# EAGLE design hw-proto04 (EAGLE 7.3.0)
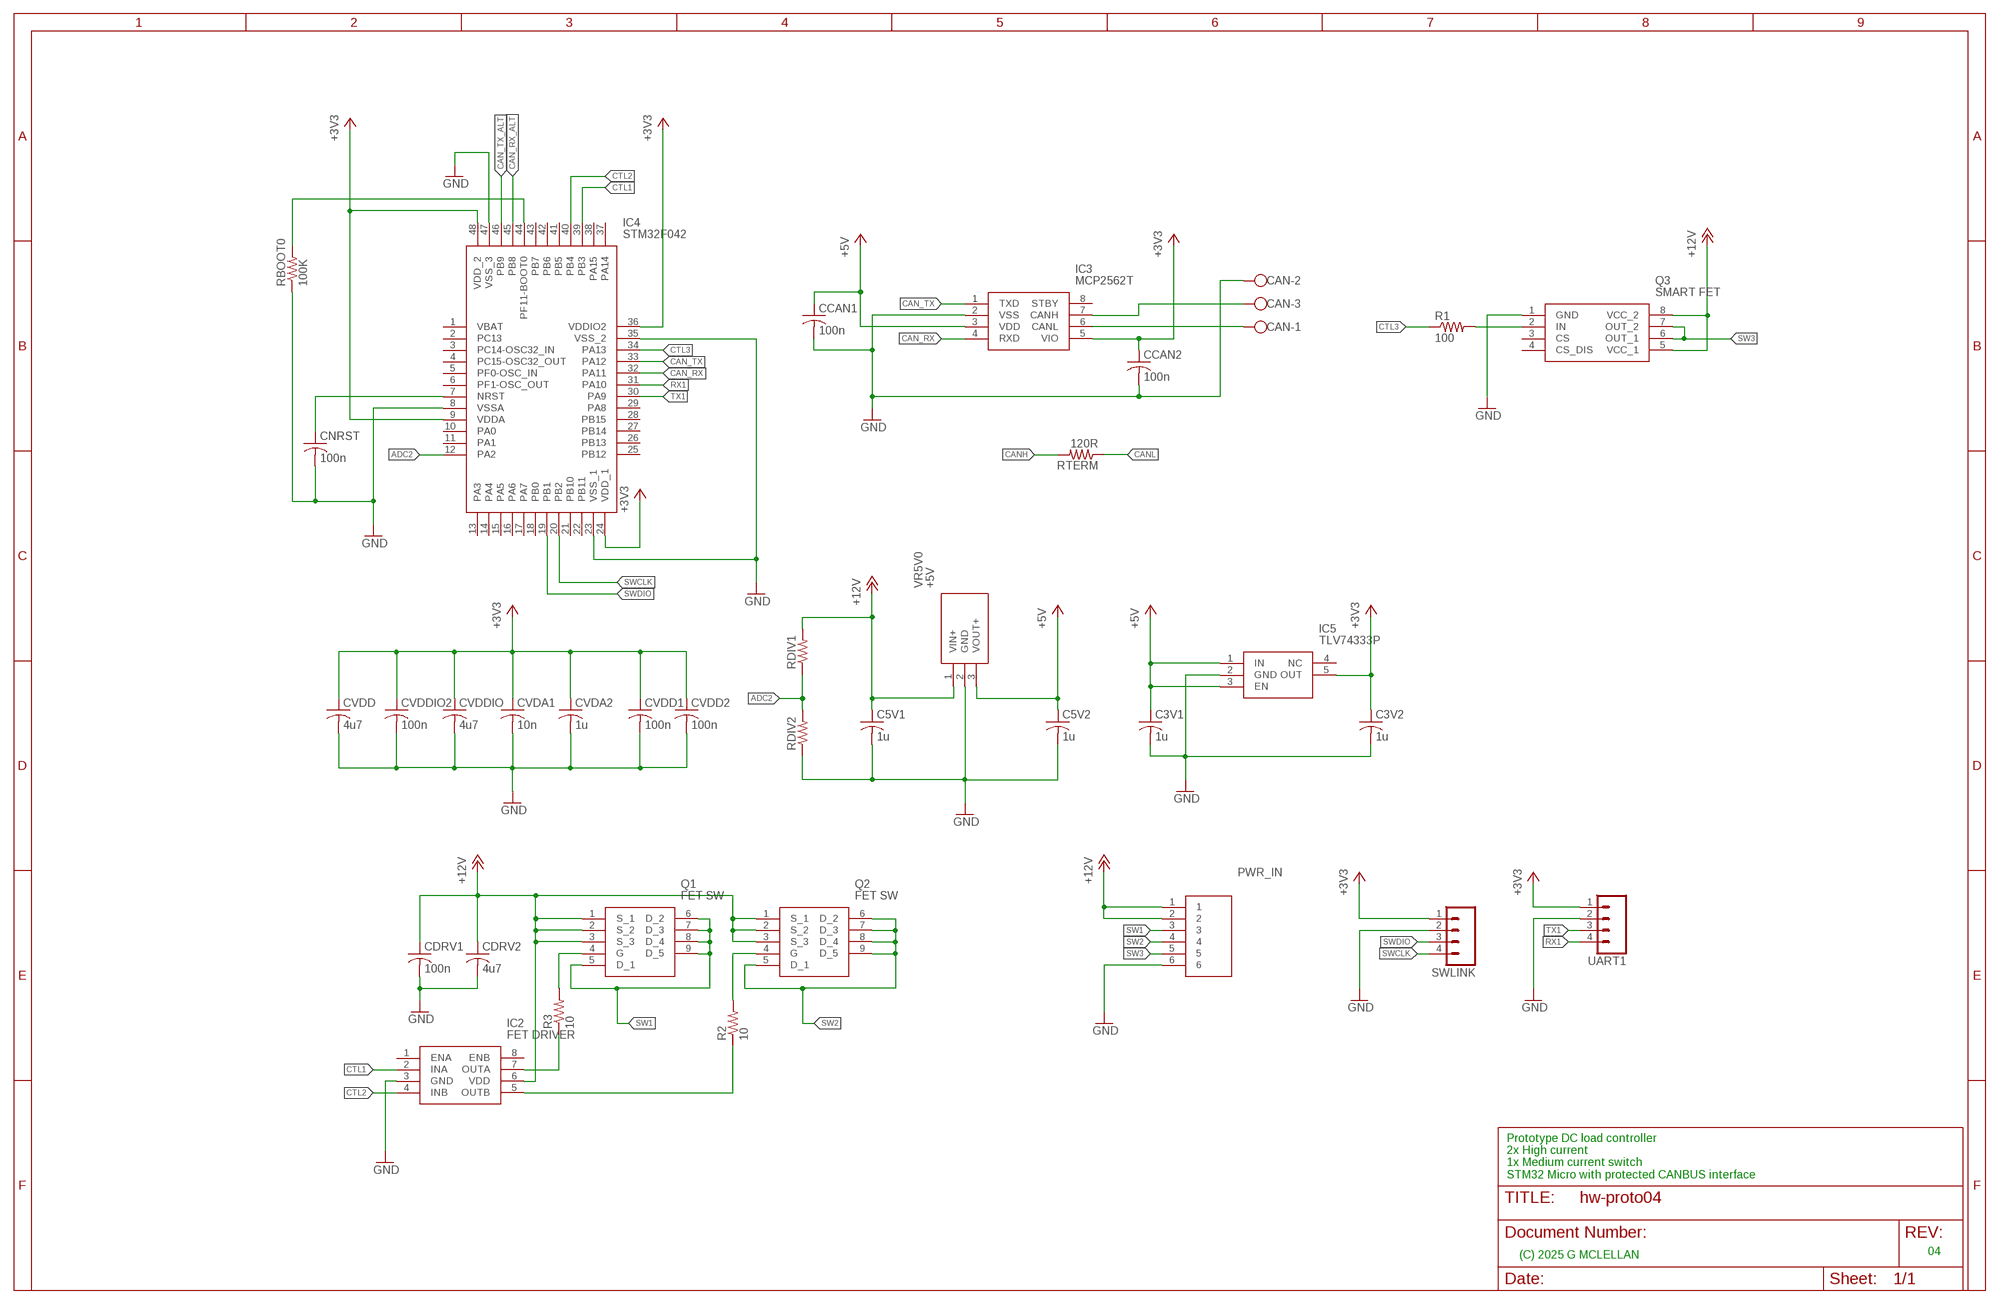
[diagram p0: schematic, sheet 1]

## Parts
C3V1  1u  C-USC0603K  [C0603K]
C3V2  1u  C-USC0603K  [C0603K]
C5V1  1u  C-USC0603K  [C0603K]
C5V2  1u  C-USC0603K  [C0603K]
CAN  W237-103  [W237-103]
CCAN1  100n  C-USC0603K  [C0603K]
CCAN2  100n  C-USC0603K  [C0603K]
CDRV1  100n  C-USC0603K  [C0603K]
CDRV2  4u7  C-USC0805K  [C0805K]
CNRST  100n  C-USC0603K  [C0603K]
CVDA1  10n  C-USC0603K  [C0603K]
CVDA2  1u  C-USC0603K  [C0603K]
CVDD  4u7  C-USC0603K  [C0603K]
CVDD1  100n  C-USC0603K  [C0603K]
CVDD2  100n  C-USC0603K  [C0603K]
CVDDIO  4u7  C-USC0603K  [C0603K]
CVDDIO2  100n  C-USC0603K  [C0603K]
IC2  FET DRIVER  UCC27523DR  [SOIC127P600X175-8N]
IC3  MCP2562T  MCP2562T-H_SN  [SOIC127P600X175-8N]
IC4  STM32F042  STM32F042C6T7  [QFP50P900X900X160-48N]
IC5  TLV74333P  TLV74333PDBVR  [SOT95P280X145-5N]
PWR_IN  4DB-P108-06  [4DBP10806]
Q1  FET SW  SQJ147ELP-T1_GE3  [SQJ147ELPT1_GE3]
Q2  FET SW  SQJ147ELP-T1_GE3  [SQJ147ELPT1_GE3]
Q3  SMART FET  VN5E160MSTR-E  [SOIC127P600X175-8N]
R1  100  R-US_0204/7  [0204/7]
R2  10  R-US_0204/7  [0204/7]
R3  10  R-US_0204/7  [0204/7]
RBOOT0  100K  R-US_R0603  [R0603]
RDIV1  R-US_R0805  [R0805]
RDIV2  R-US_R0805  [R0805]
RTERM  120R  R-US_R0805  [R0805]
SWLINK  M04LOCK  [1X04_LOCK]
UART1  M04LOCK  [1X04_LOCK]
VR5V0  +5V  TSR_1-2433E  [TSR-1-2433]

## Nets
+3V3: C3V2.1 CCAN2.1 CVDA1.1 CVDA2.1 CVDD1.1 CVDD2.1 CVDD.1 CVDDIO2.1 CVDDIO.1 IC3.5(VIO) IC4.9(VDDA) IC4.24(VDD_1) IC4.36(VDDIO2) IC4.48(VDD_2) IC5.5(OUT) SWLINK.1 UART1.1
+5V: C3V1.1 C5V2.1 CCAN1.1 IC3.3(VDD) IC5.1(IN) IC5.3(EN) VR5V0.3(VOUT+)
+12V: C5V1.1 CDRV1.1 CDRV2.1 IC2.6(VDD) PWR_IN.1 PWR_IN.2 Q1.1(S_1) Q1.2(S_2) Q1.3(S_3) Q2.1(S_1) Q2.2(S_2) Q2.3(S_3) Q3.5(VCC_1) Q3.8(VCC_2) RDIV1.2 VR5V0.1(VIN+)
ADC2: IC4.12(PA2) RDIV1.1 RDIV2.2
BOOT0: IC4.44(PF11-BOOT0) RBOOT0.2
CAN_RX: IC3.4(RXD) IC4.32(PA11)
CAN_RX_ALT: IC4.45(PB8)
CAN_TX: IC3.1(TXD) IC4.33(PA12)
CAN_TX_ALT: IC4.46(PB9)
CANH: CAN.3 IC3.7(CANH) RTERM.2
CANL: CAN.1 IC3.6(CANL) RTERM.1
CTL1: IC2.2(INA) IC4.39(PB3)
CTL2: IC2.4(INB) IC4.40(PB4)
CTL3: IC4.34(PA13) R1.1
GND: C3V1.2 C3V2.2 C5V1.2 C5V2.2 CAN.2 CCAN1.2 CCAN2.2 CDRV1.2 CDRV2.2 CNRST.2 CVDA1.2 CVDA2.2 CVDD1.2 CVDD2.2 CVDD.2 CVDDIO2.2 CVDDIO.2 IC2.3(GND) IC3.2(VSS) IC4.8(VSSA) IC4.23(VSS_1) IC4.35(VSS_2) IC4.47(VSS_3) IC5.2(GND) PWR_IN.6 Q3.1(GND) RBOOT0.1 RDIV2.1 SWLINK.2 UART1.2 VR5V0.2(GND)
N$3: IC2.5(OUTB) R2.1
N$4: IC2.7(OUTA) R3.1
N$5: Q1.4(G) R3.2
N$6: Q2.4(G) R2.2
N$7: Q3.2(IN) R1.2
N$8: CNRST.1 IC4.7(NRST)
RX1: IC4.31(PA10) UART1.4
SW1: PWR_IN.3 Q1.5(D_1) Q1.6(D_2) Q1.7(D_3) Q1.8(D_4) Q1.9(D_5)
SW2: PWR_IN.4 Q2.5(D_1) Q2.6(D_2) Q2.7(D_3) Q2.8(D_4) Q2.9(D_5)
SW3: PWR_IN.5 Q3.6(OUT_1) Q3.7(OUT_2)
SWCLK: IC4.20(PB2) SWLINK.4
SWDIO: IC4.19(PB1) SWLINK.3
TX1: IC4.30(PA9) UART1.3
Unconnected: IC2.1(ENA) IC2.8(ENB) IC3.8(STBY) IC4.1(VBAT) IC4.2(PC13) IC4.3(PC14-OSC32_IN) IC4.4(PC15-OSC32_OUT) IC4.5(PF0-OSC_IN) IC4.6(PF1-OSC_OUT) IC4.10(PA0) IC4.11(PA1) IC4.13(PA3) IC4.14(PA4) IC4.15(PA5) IC4.16(PA6) IC4.17(PA7) IC4.18(PB0) IC4.21(PB10) IC4.22(PB11) IC4.25(PB12) IC4.26(PB13) IC4.27(PB14) IC4.28(PB15) IC4.29(PA8) IC4.37(PA14) IC4.38(PA15) IC4.41(PB5) IC4.42(PB6) IC4.43(PB7) IC5.4(NC) Q3.3(CS) Q3.4(CS_DIS)

## Notes on the sheet
- Prototype DC load controller
  2x High current 
  1x Medium current switch 
  STM32 Micro with protected CANBUS interface
- 04
- (C) 2025 G MCLELLAN

## Library data of the parts
C3V1 C3V2 C5V1 C5V2 CCAN1 CCAN2 CDRV1 CDRV2 CNRST CVDA1 CVDA2 CVDD CVDD1 CVDD2 CVDDIO CVDDIO2 = rcl:C-US: CAPACITOR, American symbol
CAN = con-wago-500:W237-103: WAGO SCREW CLAMP; MPN: 237-103; OC_FARNELL: unknown; OC_NEWARK: 18M7116
IC2 = UCC27523DR-fet-driver:UCC27523DR: Dual, 5A, High-Speed Low-Side Power MOSFET Driver Source: Datasheet <http://www.ti.com/lit/gpn/ucc27523>; DESCRIPTION: Dual, 5A, High-Speed Low-Side Power MOSFET Driver; HEIGHT: 1.75mm; MANUFACTURER_NAME: Texas Instruments; MANUFACTURER_PART_NUMBER: UCC27523DR; MOUSER_PART_NUMBER: 595-UCC27523DR; MOUSER_PRICE-STOCK: https://www.mouser.co.uk/ProductDetail/Texas-Instruments/UCC27523DR/?qs=JK0Mn6q9DKQ5jNt3UHw5hw%3D%3D
IC3 = MCP2562T-H_SN:MCP2562T-H_SN: CAN Interface IC Source: Datasheet <https://componentsearchengine.com/Datasheets/1/MCP2562T-H_SN.pdf>; DESCRIPTION: CAN Interface IC; HEIGHT: 1.75mm; MANUFACTURER_NAME: Microchip; MANUFACTURER_PART_NUMBER: MCP2562T-H/SN; MOUSER_PART_NUMBER: 579-MCP2562T-H/SN; MOUSER_PRICE-STOCK: https://www.mouser.co.uk/ProductDetail/Microchip-Technology/MCP2562T-H-SN?qs=eTPcRhULBzwloCb8Xxk0jQ%3D%3D
IC4 = STM32F042C6T7:STM32F042C6T7: Mainstream Arm Cortex-M0 USB line MCU with 32 Kbytes of Flash memory, 48 MHz CPU, USB, CAN and CEC functions Source: Datasheet <https://www.st.com/resource/en/datasheet/stm32f042c4.pdf>; DESCRIPTION: Mainstream Arm Cortex-M0 USB line MCU with 32 Kbytes of Flash memory, 48 MHz CPU, USB, CAN and CEC functions; HEIGHT: 1.6mm; MANUFACTURER_NAME: STMicroelectronics; MANUFACTURER_PART_NUMBER: STM32F042C6T7; MOUSER_PART_NUMBER: 511-STM32F042C6T7; MOUSER_PRICE-STOCK: https://www.mouser.co.uk/ProductDetail/STMicroelectronics/STM32F042C6T7?qs=PqoDHHvF6499eidad5TESA%3D%3D
IC5 = TLV74333PDBVR:TLV74333PDBVR: 300mA Low-Dropout (LDO) Regulator Source: Datasheet <http://www.ti.com/lit/gpn/tlv743p>; DESCRIPTION: 300mA Low-Dropout (LDO) Regulator; HEIGHT: 1.45mm; MANUFACTURER_NAME: Texas Instruments; MANUFACTURER_PART_NUMBER: TLV74333PDBVR; MOUSER_PART_NUMBER: 595-TLV74333PDBVR; MOUSER_PRICE-STOCK: https://www.mouser.co.uk/ProductDetail/Texas-Instruments/TLV74333PDBVR?qs=EU6FO9ffTwe08kePOwcQGA%3D%3D
PWR_IN = 4DB-P108-06:4DB-P108-06: Dual Barrier, Printed Circuit Pin, Wire-to-Board, 6 Position, 8.26 mm [.325 in] Centerline, 1 Row, Buchanan 4DB Series, Barrier Strips Source: Datasheet <https://www.te.com/commerce/DocumentDelivery/DDEController?Action=srchrtrv&DocNm=1-1773458-2_BARRIER_STRIPS_QRG&DocType=Data Sheet&DocLang=English&PartCntxt=2-1437667-9&DocFormat=pdf>; DESCRIPTION: Dual Barrier, Printed Circuit Pin, Wire-to-Board, 6 Position, 8.26 mm [.325 in] Centerline, 1 Row, Buchanan 4DB Series, Barrier Strips; HEIGHT: 13.716mm; MANUFACTURER_NAME: TE Connectivity; MANUFACTURER_PART_NUMBER: 4DB-P108-06; MOUSER_PART_NUMBER: N/A; MOUSER_PRICE-STOCK: https://www.mouser.co.uk/ProductDetail/TE-Connectivity/4DB-P108-06?qs=JZD3Rbs9Xzm1xbyNfnCHaQ%3D%3D
Q1 Q2 = transistor-vishay-pchan-pso8:SQJ147ELP-T1_GE3: MOSFET P-CHANNEL 40-V (D-S) 175C MOSFET Source: Datasheet <https://www.vishay.com/docs/77857/sqj147elp.pdf>; DESCRIPTION: MOSFET P-CHANNEL 40-V (D-S) 175C MOSFET; HEIGHT: 1.227mm; MANUFACTURER_NAME: Vishay; MANUFACTURER_PART_NUMBER: SQJ147ELP-T1_GE3; MOUSER_PART_NUMBER: 78-SQJ147ELP-T1_GE3; MOUSER_PRICE-STOCK: https://www.mouser.co.uk/ProductDetail/Vishay-Siliconix/SQJ147ELP-T1_GE3?qs=81r%252BiQLm7BRdyhBg3DuaKw%3D%3D
Q3 = VN5E160MSTR-E:VN5E160MSTR-E: Gate Drivers SNGL CH HI-SIDE DRVR W/ANALOG CRRNT SNSE Source: Datasheet <https://componentsearchengine.com/Datasheets/2/VN5E160MSTR-E.pdf>; DESCRIPTION: Gate Drivers SNGL CH HI-SIDE DRVR W/ANALOG CRRNT SNSE; HEIGHT: 1.75mm; MANUFACTURER_NAME: STMicroelectronics; MANUFACTURER_PART_NUMBER: VN5E160MSTR-E; MOUSER_PART_NUMBER: 511-VN5E160MSTR-E; MOUSER_PRICE-STOCK: https://www.mouser.co.uk/ProductDetail/STMicroelectronics/VN5E160MSTR-E?qs=WSSg0AwdCh77XxtxsYEeyw%3D%3D
R1-R3 RBOOT0 RDIV1 RDIV2 RTERM = rcl:R-US_: RESISTOR, American symbol
SWLINK UART1 = SparkFun-Connectors:M04: Header 4 Standard 4-pin 0.1" header. Use with straight break away headers (SKU : PRT-00116), right angle break away headers (PRT-00553), swiss pins (PRT-00743), machine pins (PRT-00117), and female headers (PRT-00115). Molex polarized connector foot print use with SKU : PRT-08231 with associated crimp pins and housings. 1MM SMD Version SKU: PRT-10208; PROD_ID: CONN-09696
VR5V0 = TSR_1-2433E:TSR_1-2433E: 1 Amp POL converter, industrial, 6-36 VDC input, pos.-pos. circuit, cost efficient, LM78 compatible, SIP-3 Source: Datasheet <https://tracopower.com/tsr1e-datasheet/>; DESCRIPTION: 1 Amp POL converter, industrial, 6-36 VDC input, pos.-pos. circuit, cost efficient, LM78 compatible, SIP-3; HEIGHT: mm; MANUFACTURER_NAME: Traco Power; MANUFACTURER_PART_NUMBER: TSR 1-2433E; MOUSER_PART_NUMBER: 495-TSR1-2433E; MOUSER_PRICE-STOCK: https://www.mouser.co.uk/ProductDetail/TRACO-Power/TSR-1-2433E?qs=vmHwEFxEFR9haWIzn8wG3A%3D%3D

## Board
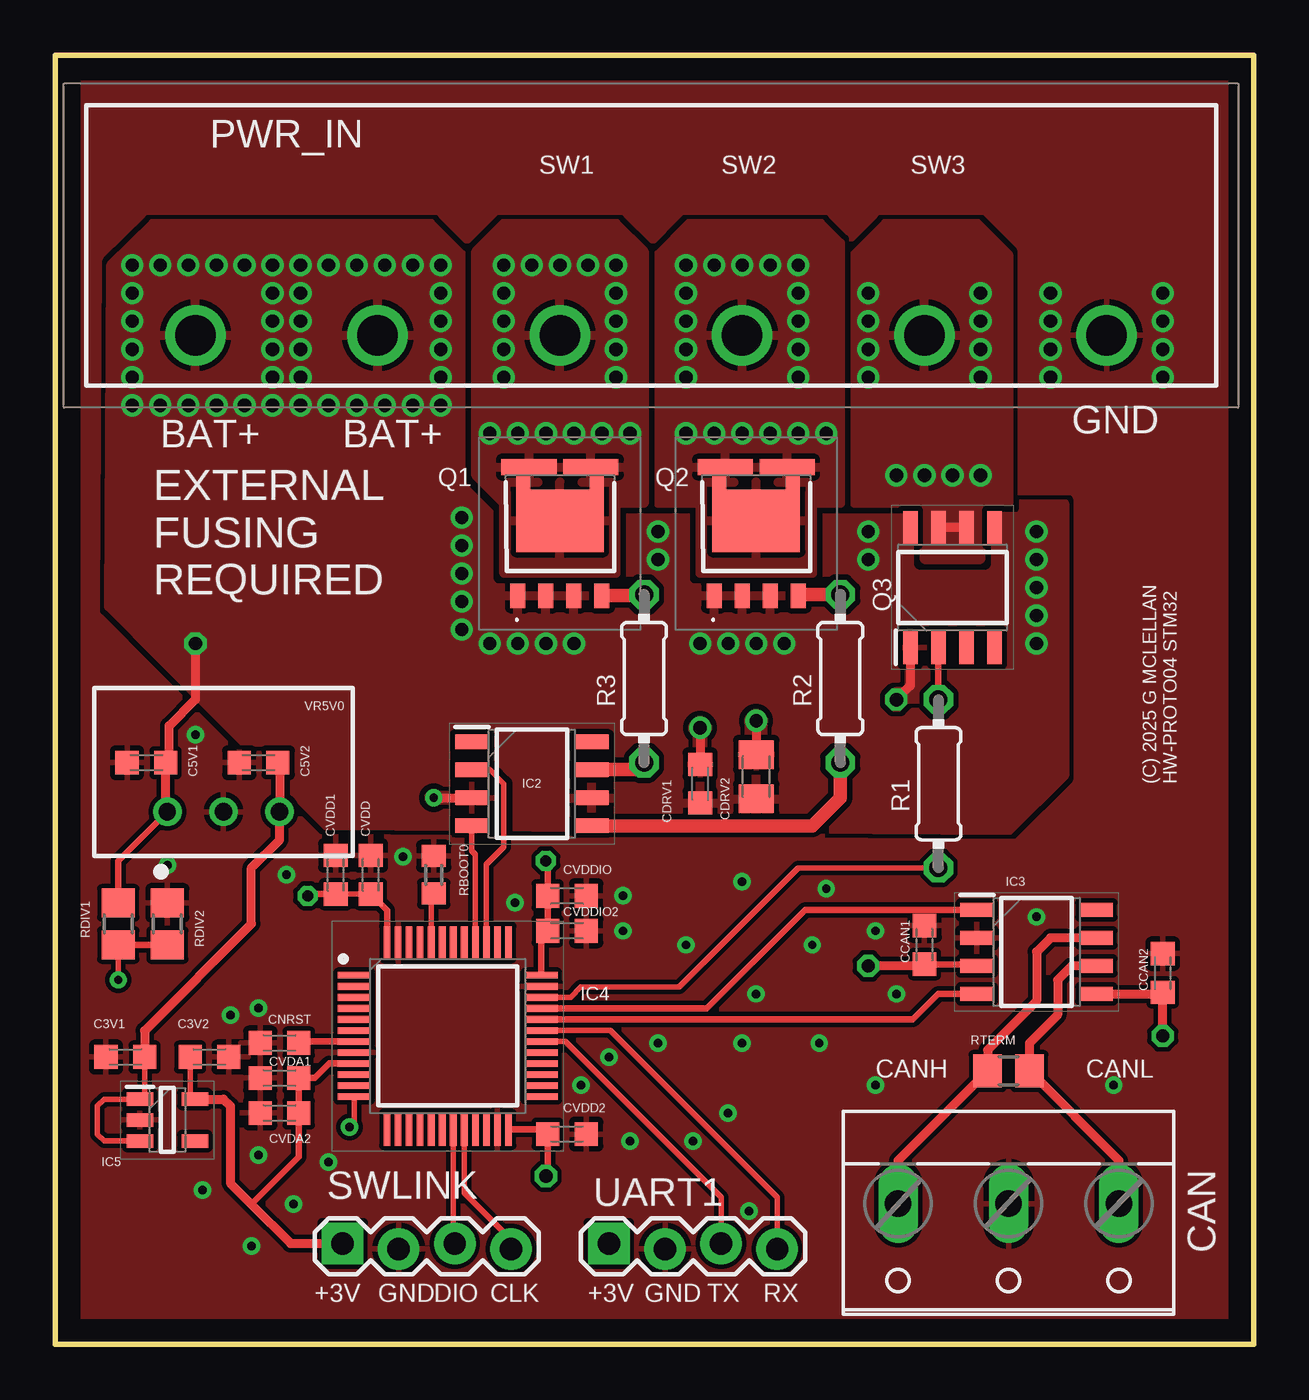
[diagram p1: board, top side]
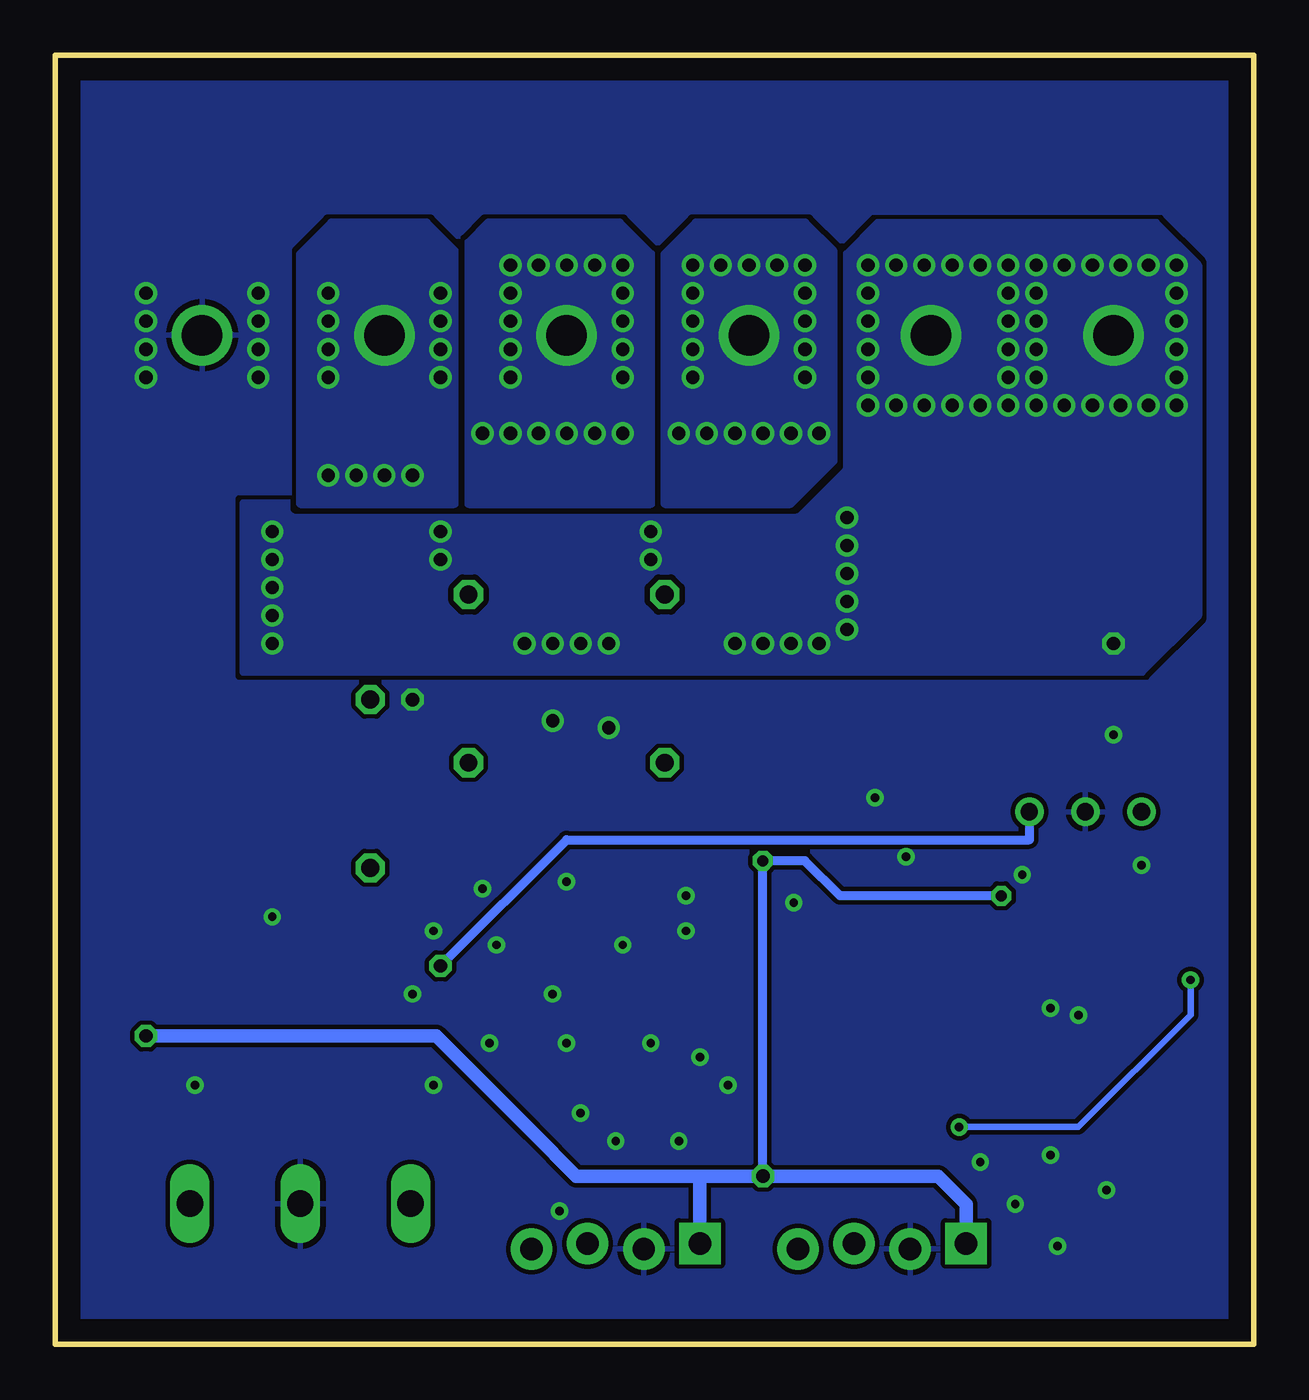
[diagram p2: board, bottom side, seen from below]

Size 54.28 x 58.41 mm. Coordinates in mm from the lower left corner, seen from the top.
Outline: 0,0 54.28,0 54.28,58.41 0,58.41 0,0
Copper layers (1*16): Top 0.035mm / dielectric 1.5mm / Bottom 0.035mm
Design rules "default": minimum track width 10mil, minimum drill 24mil, track to track 8mil, track to pad 8mil, pad to pad 8mil, via to via 8mil, smd to smd 8mil, copper to edge 40mil, drill to drill 8mil, minimum pad ring 10mil, minimum via ring 8mil, stop-mask expansion 4mil, vias tented up to drill 0mil, thermal gap 10mil

### Footprints (pad centres in the part's own frame; a part is rotated, then mirrored left to right if it is on the bottom)
C0603K = smd 1.05 x 1.08: 1 -0.875,0; 2 0.875,0
W237-103 = drill 1.194 long: 1 -5,-1.29; 2 0,-1.29; 3 5,-1.29
C0805K = smd 1.3 x 1.6: 1 -1,0; 2 1,0
SOIC127P600X175-8N = smd 1.525 x 0.65: 1 -2.712,1.905; 2 -2.712,0.635; 3 -2.712,-0.635; 4 -2.712,-1.905; 5 2.712,-1.905; 6 2.712,-0.635; 7 2.712,0.635; 8 2.712,1.905
SOIC127P600X175-8N' = smd 1.5 x 0.65: 1 -2.7,1.905; 2 -2.7,0.635; 3 -2.7,-0.635; 4 -2.7,-1.905; 5 2.7,-1.905; 6 2.7,-0.635; 7 2.7,0.635; 8 2.7,1.905
QFP50P900X900X160-48N = smd 1.475 x 0.3: 1 -4.238,2.75; 2 -4.238,2.25; 3 -4.238,1.75; 4 -4.238,1.25; 5 -4.238,0.75; 6 -4.238,0.25; 7 -4.238,-0.25; 8 -4.238,-0.75; 9 -4.238,-1.25; 10 -4.238,-1.75; 11 -4.238,-2.25; 12 -4.238,-2.75; 25 4.238,-2.75; 26 4.238,-2.25; 27 4.238,-1.75; 28 4.238,-1.25; 29 4.238,-0.75; 30 4.238,-0.25; 31 4.238,0.25; 32 4.238,0.75; 33 4.238,1.25; 34 4.238,1.75; 35 4.238,2.25; 36 4.238,2.75 | smd 0.3 x 1.475: 13 -2.75,-4.238; 14 -2.25,-4.238; 15 -1.75,-4.238; 16 -1.25,-4.238; 17 -0.75,-4.238; 18 -0.25,-4.238; 19 0.25,-4.238; 20 0.75,-4.238; 21 1.25,-4.238; 22 1.75,-4.238; 23 2.25,-4.238; 24 2.75,-4.238; 37 2.75,4.238; 38 2.25,4.238; 39 1.75,4.238; 40 1.25,4.238; 41 0.75,4.238; 42 0.25,4.238; 43 -0.25,4.238; 44 -0.75,4.238; 45 -1.25,4.238; 46 -1.75,4.238; 47 -2.25,4.238; 48 -2.75,4.238
SOT95P280X145-5N = smd 1.2 x 0.6: 1 -1.25,0.95; 2 -1.25,0; 3 -1.25,-0.95; 4 1.25,-0.95; 5 1.25,0.95
4DBP10806 = drill 1.829 pad 2.743: 1 0,0; 2 8.255,0; 3 16.51,0; 4 24.765,0; 5 33.02,0; 6 41.275,0
SQJ147ELPT1_GE3 = smd 0.68 x 1.1: 1 -1.905,-2.913; 2 -0.635,-2.913; 3 0.635,-2.913; 4 1.905,-2.913 | smd 2.5 x 0.71: 5 1.4,2.913; 6 -1.4,2.913 | smd 0.63 x 0.66: 7 1.665,2.228; 8 -1.665,2.228 | smd 3.96 x 2.82: 9 0,0.487
0204/7 = drill 0.813 octagon: 1 -3.81,0; 2 3.81,0
R0603 = smd 1 x 1.1: 1 -0.85,0; 2 0.85,0
R0805 = smd 1.3 x 1.5: 1 -0.95,0; 2 0.95,0
1X04_LOCK = drill 1.016 pad 1.88 square: 1 0,0.127 | drill 1.016 pad 1.88: 2 2.54,-0.127; 3 5.08,0.127; 4 7.62,-0.127
TSR-1-2433 = drill 0.78 pad 1.28: 1 -2.54,0; 2 0,0; 3 2.54,0

### Placement (x,y rotation side)
C3V1  3.18,13.02 180 top
C3V2  6.99,13.02 0 top
C5V1  4.13,26.35 180 top
C5V2  9.21,26.35 180 top
CAN  43.18,5.08 180 top
CCAN1  39.37,18.1 90 top
CCAN2  50.16,16.83 90 top
CDRV1  29.21,25.4 90 top
CDRV2  31.75,25.72 90 top
CNRST  10.16,13.65 180 top
CVDA1  10.16,12.06 180 top
CVDA2  10.16,10.48 180 top
CVDD  14.29,21.27 90 top
CVDD1  12.7,21.27 90 top
CVDD2  23.18,9.53 0 top
CVDDIO  23.18,20.32 0 top
CVDDIO2  23.18,18.73 0 top
IC2  21.59,25.4 0 top
IC3  MCP2562T  [SOIC127P600X175-8N']  44.45,17.78 0 top
IC4  17.78,13.97 0 top
IC5  5.08,10.16 0 top
PWR_IN  6.35,45.72 0 top
Q1  22.86,36.83 0 top
Q2  31.75,36.83 0 top
Q3  40.64,34.29 90 top
R1  40,25.4 90 top
R2  35.56,30.16 90 top
R3  26.67,30.16 90 top
RBOOT0  17.14,21.27 270 top
RDIV1  2.86,19.05 90 top
RDIV2  5.08,19.05 270 top
RTERM  43.18,12.38 180 top
SWLINK  13.02,4.45 0 top
UART1  25.08,4.45 0 top
VR5V0  7.62,24.13 0 top

### Tracks (layer width: path | path; a pad name or v marks a point on that pad's centre or on a via)
+3V3  (via drill 0.5, 0.6)
  Top 0.254: CVDD1.1 CVDD.1 | C3V2.1 6.11,11.33 IC5.5
  Top 0.305: IC4.24 22.1,9.73 CVDD2.1 22.3,7.7 v22.23,7.62 | IC4.36 22.02,18.45 CVDDIO2.1 CVDDIO.1 22.3,21.83 v22.23,21.91 | IC4.9 12.4,12.72 11.75,12.06 CVDA1.1 CVDA2.1 11.04,8.49 8.89,6.35 | CVDD1.1 11.51,20.4 v11.43,20.32 | CVDD.1 15.03,19.66 IC4.48
  Top 0.406: CVDD2.1 22.23,9.53 | IC5.5 7.62,11.11 7.94,10.79 7.94,7.3 8.89,6.35 10.67,4.57 SWLINK.1 | v50.16,13.97 CCAN2.1 50.09,15.88 IC3.5
  Bottom 0.406: v11.43,20.32 18.73,20.32 20.32,21.91 v22.23,21.91 v22.23,7.62
  Bottom 0.61: v50.16,13.97 37.02,13.97 32.7,9.65 30.67,7.62 25.4,7.62 25.08,7.62 | 25.08,7.62 v22.23,7.62 14.29,7.62 13.02,6.35 SWLINK.1 | UART1.1 25.08,7.62
+5V  (via drill 0.6)
  Top 0.254: C3V1.1 4.05,11.33 IC5.1 2.22,11.11 1.9,10.79 1.9,9.53 2.22,9.21 IC5.3
  Top 0.305: CCAN1.1 41.67,17.22 IC3.3
  Top 0.406: CCAN1.1 39.37,17.14 v36.83,17.14 | C3V1.1 4.05,14.21 8.89,19.05 8.89,21.59 10.16,22.86 VR5V0.3 10.16,26.35 C5V2.1
  Bottom 0.406: VR5V0.3 10.16,22.86 31.11,22.86 v36.83,17.14
+12V  (via drill 0.6)
  Top 0.305: RDIV1.2 2.86,21.91 VR5V0.1 5,24.13
  Top 0.406: v6.35,31.75 6.35,29.21 5.16,28.02 5.16,26.35 C5V1.1 5,24.13
  other vias: 3.49,47.62 17.46,46.35 17.46,45.09 17.46,43.81 3.49,46.35 3.49,45.09 3.49,43.81 18.41,33.66 18.41,32.38 44.45,35.56 44.45,31.75 44.45,36.83 3.49,42.55 4.76,42.55 6.03,42.55 7.3,42.55 8.57,42.55 9.84,42.55 11.11,42.55 12.38,42.55 19.68,31.75 20.96,31.75 22.23,31.75 23.5,31.75 18.41,34.92 18.41,36.2 27.3,36.83 27.3,35.56 29.21,31.75 30.48,31.75 31.75,31.75 33.02,31.75 36.83,36.83 36.83,35.56 18.41,37.47 13.65,42.55 14.92,42.55 16.19,42.55 17.46,42.55 9.84,43.81 9.84,45.09 9.84,46.35 9.84,47.62 11.11,47.62 11.11,46.35 11.11,45.09 11.11,43.81 3.49,48.9 4.76,48.9 6.03,48.9 7.3,48.9 8.57,48.9 9.84,48.9 11.11,48.9 12.38,48.9 13.65,48.9 14.92,48.9 16.19,48.9 17.46,48.9 17.46,47.62 44.45,33.02 44.45,34.29
  pour Top (isolate 0.254, rank 4): 2.42,33.42 2.53,48.91 4.43,50.8 17,50.8 18.41,49.38 18.41,40.35 20.66,38.1 45.72,38.1 45.72,25.77 43.2,23.26 12.27,23.5
  pour Top (isolate 0.254, rank 4, no thermals): 35.56,38.1 45.72,38.1 45.72,29.21 35.56,29.21
  pour Bottom (isolate 0.254, rank 4, no thermals): 17,50.8 4.45,50.8 2.54,48.9 2.54,33.02 5.08,30.48 45.72,30.48 45.72,38.1 20.66,38.1 18.41,40.35 18.41,49.38
ADC2  (via drill 0.38)
  Top 0.254: v2.86,16.51 RDIV1.1 | IC4.12 13.54,10.05 v13.34,9.84
  Top 0.305: RDIV2.2 RDIV1.1
  Bottom 0.305: v13.34,9.84 7.94,9.84 2.86,14.92 v2.86,16.51
BOOT0
  Top 0.254: IC4.44 17.03,20.31 RBOOT0.2
CAN_RX
  Top 0.305: IC4.32 38.85,14.72 40,15.88 IC3.4
CAN_TX
  Top 0.305: IC3.1 33.97,19.68 29.51,15.22 IC4.33
CANH
  Top 0.406: CAN.3 38.18,8.33 RTERM.2 42.23,13.34 43.5,14.61 44.45,15.56 44.45,17.78 45.08,18.41 IC3.7
CANL
  Top 0.406: CAN.1 48.18,8.33 RTERM.1 44.13,13.65 45.4,14.92 45.4,16.51 46.04,17.14 IC3.6
CTL1
  Top 0.254: IC2.2 19.68,26.04 20.32,25.4 20.32,22.54 19.53,21.75 IC4.39
CTL2
  Top 0.254: IC4.40 19.03,22.2 18.88,22.36 IC2.4
CTL3
  Top 0.254: R1.1 33.65,21.59 28.26,16.19 23.81,16.19 23.34,15.72 IC4.34
GND  (via drill 0.38, 0.6)
  Top 0.406: Q3.1 38.73,29.84 v38.1,29.21 | v29.21,27.94 CDRV1.2 | v31.75,28.26 CDRV2.2 | v17.14,24.77 IC2.3
  other vias: 45.08,43.81 45.08,45.09 45.08,46.35 45.08,47.62 50.16,47.62 50.16,46.35 50.16,45.09 50.16,43.81 20.83,20 25.72,18.73 25.72,20.32 26.04,9.21 9.21,8.57 7.94,14.92 9.21,15.24 23.81,11.75 6.35,27.62 12.38,8.26 10.79,6.35 5.08,21.72 37.15,18.73 15.75,22.1 10.48,21.27 25.08,13.02 27.3,13.65 44.45,19.37 34.61,13.65 31.11,13.65 31.75,15.88 34.29,18.1 38.1,15.88 34.92,20.64 37.15,11.75 31.11,20.95 28.57,18.1 6.67,6.99 8.89,4.45 28.89,9.21 31.43,6.03 30.48,10.48 47.94,11.75
  pour Bottom (rank 6): 0,58.42 54.61,58.42 54.61,0 0,0
  pour Top (rank 6): 0,58.42 54.61,58.42 54.61,0 0,0
N$3
  Top 0.61: IC2.5 34.29,23.5 35.56,24.77 R2.1
N$4
  Top 0.61: IC2.7 26.35,26.04 R3.1
N$5
  Top 0.406: 26.61,33.92 R3.2
  Top 0.61: Q1.4 26.61,33.92
N$6
  Top 0.61: R2.2 33.71,33.97 Q2.4
N$7
  Top 0.305: R1.2 Q3.2
N$8
  Top 0.305: IC4.7 11.1,13.72 CNRST.1
RX1
  Top 0.254: IC4.31 25.15,14.22 32.7,6.67 UART1.4
SW1  (via drill 0.6)
  Top 0.406: Q1.6 21.2,39.74 Q1.8 | Q1.5 24.53,39.74 Q1.7
  other vias: 22.23,41.27 20.32,43.81 20.32,45.09 20.32,46.35 20.32,47.62 25.4,47.62 25.4,46.35 25.4,45.09 25.4,43.81 23.5,41.27 19.68,41.27 22.23,41.27 20.96,41.27 24.77,41.27 26.04,41.27 20.32,48.9 21.59,48.9 22.86,48.9 24.13,48.9 25.4,48.9
  pour Top (isolate 0.254): 20.32,38.1 19.05,39.37 19.05,49.53 20.32,50.8 25.4,50.8 26.67,49.53 26.67,38.1 25.4,38.1 25.4,34.92 20.32,34.92
  pour Bottom (isolate 0.254, rank 2, no thermals): 26.67,38.1 20.98,38.1 19.05,40.03 19.05,49.53 20.32,50.8 25.25,50.8 26.67,49.38
SW2  (via drill 0.6)
  Top 0.406: Q2.6 30.09,39.74 Q2.8 | Q2.5 33.41,39.74 Q2.7 33.41,37.32 Q2.9
  other vias: 28.57,47.62 28.57,46.35 28.57,45.09 28.57,43.81 31.11,41.27 33.65,47.62 33.65,46.35 33.65,45.09 33.65,43.81 32.38,41.27 33.65,41.27 34.92,41.27 29.84,41.27 28.57,41.27 28.57,47.62 28.57,48.9 28.57,48.9 29.84,48.9 31.11,48.9 32.38,48.9 33.65,48.9
  pour Top (isolate 0.254, rank 2): 27.3,38.1 27.3,49.38 28.72,50.8 34.66,50.8 35.56,49.9 35.56,38.1 34.29,38.1 34.29,34.92 29.21,34.92 29.21,38.1
  pour Bottom (isolate 0.254, rank 2, no thermals): 27.3,38.1 27.3,49.38 28.72,50.8 34.66,50.8 35.56,49.9 35.56,38.1
SW3  (via drill 0.6)
  Top 0.406: Q3.6 Q3.7
  other vias: 36.83,47.62 41.91,47.62 41.91,46.35 41.91,45.09 41.91,43.81 36.83,43.81 38.1,39.37 41.91,39.37 39.37,39.37 40.64,39.37 36.83,46.35 36.83,45.09
  pour Top (isolate 0.254, rank 3): 39.37,35.56 39.37,38.1 36.2,38.1 36.2,49.38 37.61,50.8 41.76,50.8 43.18,49.38 43.18,38.1 41.91,38.1 41.91,35.56
  pour Top (isolate 0.254, rank 2, no thermals): 39.37,38.1 39.37,35.56 41.91,35.56 41.91,38.1
  pour Bottom (isolate 0.254, rank 2, no thermals): 43.18,38.1 36.2,38.1 36.2,49.53 37.46,50.8 41.76,50.8 43.18,49.38
SWCLK
  Top 0.254: IC4.20 18.53,6.87 20.64,4.76 SWLINK.4
SWDIO
  Top 0.254: IC4.19 18.03,4.64 SWLINK.3
TX1
  Top 0.254: IC4.30 23.11,13.72 30.16,6.67 UART1.3

### Text on the board
tNames: SW1 | SW2 | SW3 | BAT+ | BAT+ | GND | EXTERNAL / FUSING / REQUIRED | (C) 2025 G MCLELLAN / HW-PROTO04 STM32 | CANH | CANL | +3V | GND | DIO | CLK | +3V | GND | TX | RX